# EAGLE design RG_Medium_Matrix (EAGLE 6.5.0)
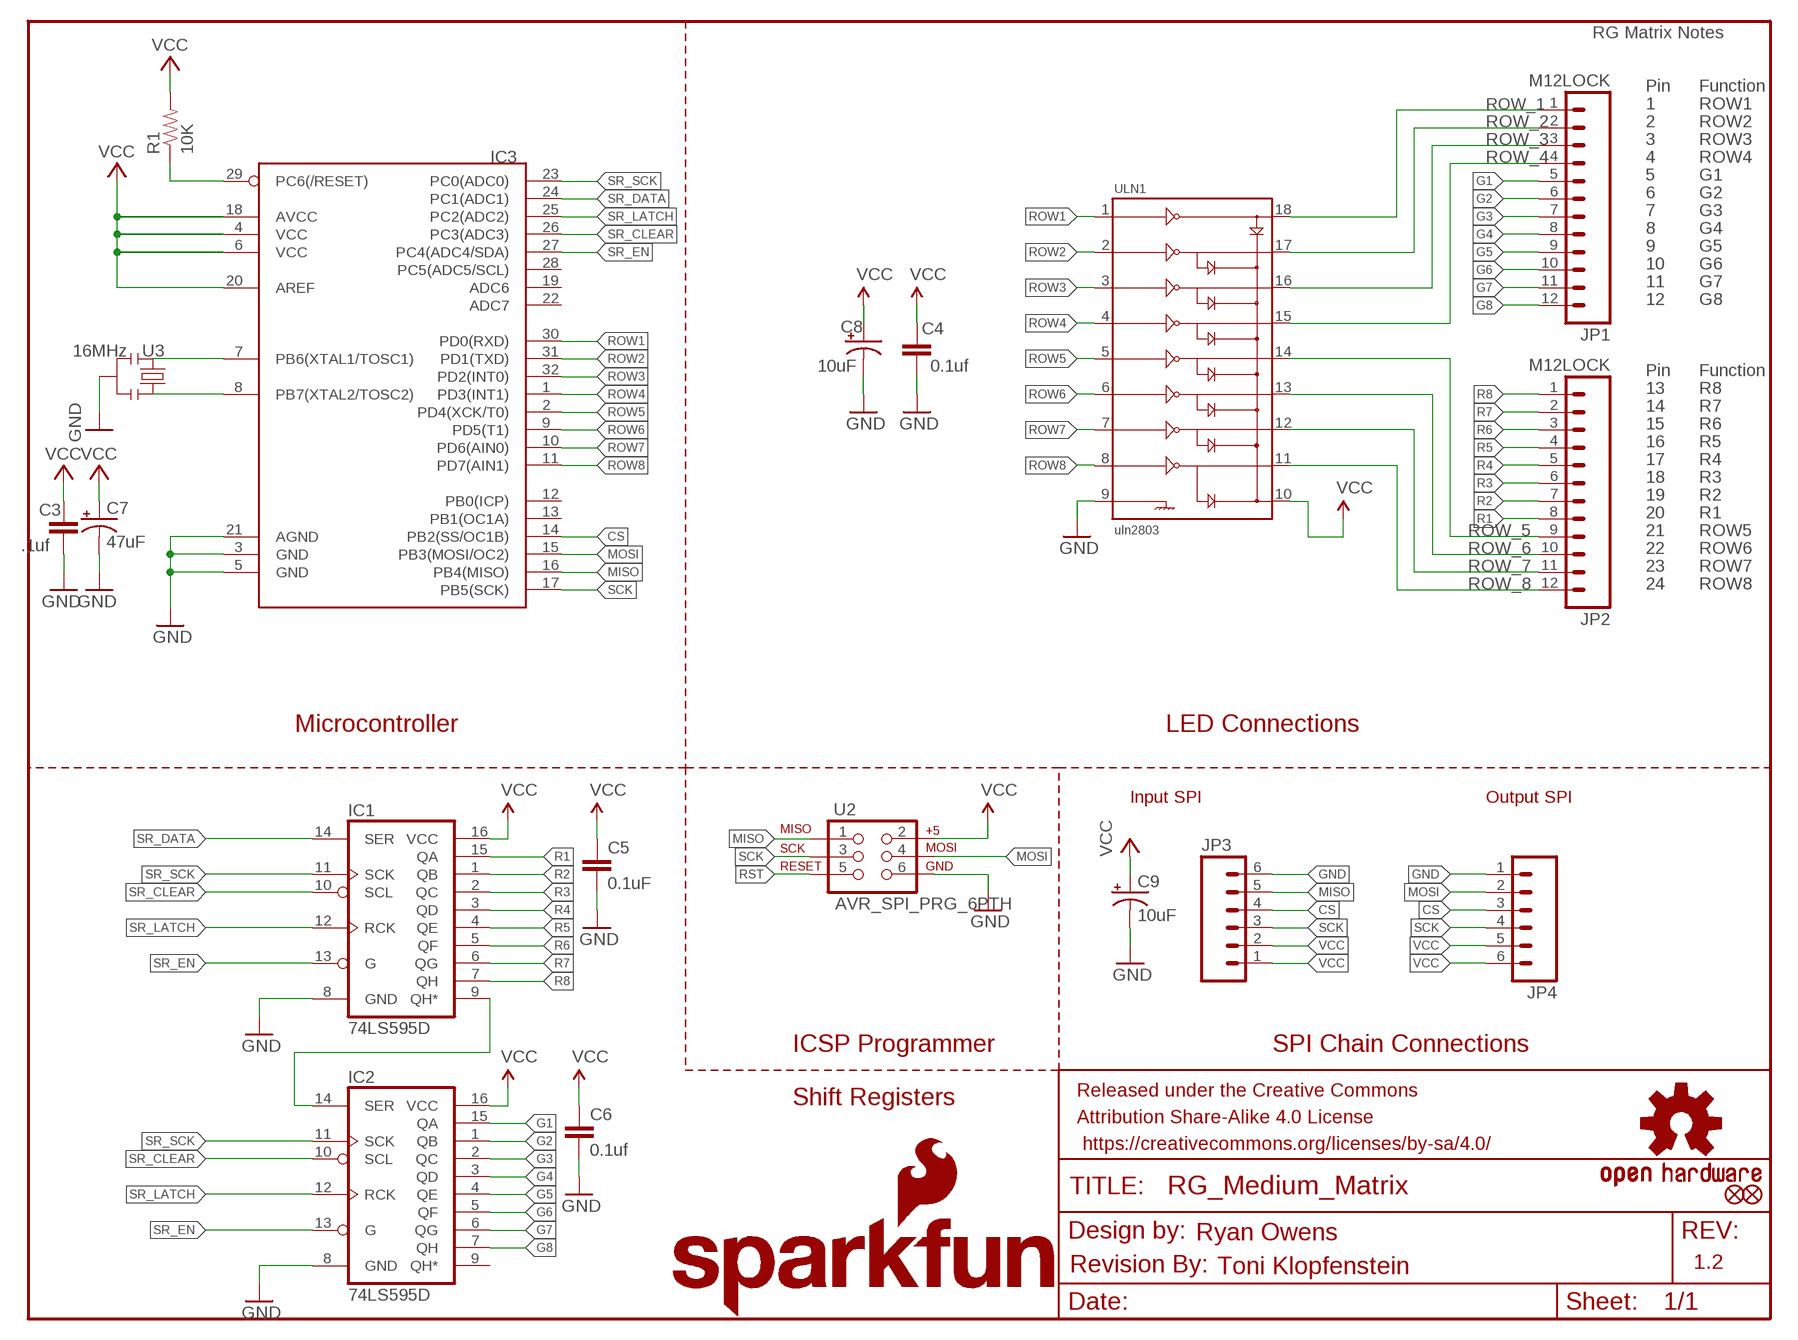
[diagram p0: schematic, sheet 1]

## Parts
C3  .1uf  0.1UF-25V(+80/-20%)(0603)  [0603-CAP]
C4  0.1uf  0.1UF-25V(+80/-20%)(0603)  [0603-CAP]
C5  0.1uF  0.1UF-25V(+80/-20%)(0603)  [0603-CAP]
C6  0.1uf  0.1UF-25V(+80/-20%)(0603)  [0603-CAP]
C7  47uF  CAP_POL3528  [EIA3528]
C8  10uF  CAP_POL1206  [EIA3216]
C9  10uF  CAP_POL1206  [EIA3216]
FRAME1  FRAME-LETTER  [CREATIVE_COMMONS]
IC1  74LS595D  [SO16]
IC2  74LS595D  [SO16]
IC3  ATMEGA328_SMT  [TQFP32-08]
JP1  M12LOCK  [1X12_LOCK]
JP2  M12LOCK  [1X12_LOCK]
JP3  M06LOCK  [1X06_LOCK]
JP4  M06LOCK  [1X06_LOCK]
LOGO1  OSHW-LOGOS  [OSHW-LOGO-S]
LOGO2  SFE_LOGO_NAME_FLAME.1_INCH  [SFE_LOGO_NAME_FLAME_.1]
R1  10K  10KOHM1/10W1%(0603)0603  [0603-RES]
U2  AVR_SPI_PRG_6PTH  [2X3]
U3  16MHz  RESONATORSMD  [RESONATOR-SMD]
U$1  FIDUCIAL1X2  [FIDUCIAL-1X2]
U$2  REVISION  [REVISION]
U$3  FIDUCIAL1X2  [FIDUCIAL-1X2]
ULN1  uln2803  ULN2803SOICW  [SO18L]

## Nets
CS: IC3.14(PB2(SS/OC1B)) JP3.4 JP4.3
G1: IC2.15(QA) JP1.5
G2: IC2.1(QB) JP1.6
G3: IC2.2(QC) JP1.7
G4: IC2.3(QD) JP1.8
G5: IC2.4(QE) JP1.9
G6: IC2.5(QF) JP1.10
G7: IC2.6(QG) JP1.11
G8: IC2.7(QH) JP1.12
GND: C3.2 C4.1 C5.2 C6.2 C7.C(-) C8.C(-) C9.C(-) IC1.8(GND) IC2.8(GND) IC3.3(GND) IC3.5(GND) IC3.21(AGND) JP3.6 JP4.1 U2.6 U3.2 ULN1.9
MISO: IC3.16(PB4(MISO)) JP3.5 U2.1
MOSI: IC3.15(PB3(MOSI/OC2)) JP4.2 U2.4
N$1: IC3.7(PB6(XTAL1/TOSC1)) U3.1
N$2: IC3.8(PB7(XTAL2/TOSC2)) U3.3
N$30: IC1.9(QH*) IC2.14(SER)
R1: IC1.15(QA) JP2.8
R2: IC1.1(QB) JP2.7
R3: IC1.2(QC) JP2.6
R4: IC1.3(QD) JP2.5
R5: IC1.4(QE) JP2.4
R6: IC1.5(QF) JP2.3
R7: IC1.6(QG) JP2.2
R8: IC1.7(QH) JP2.1
ROW1: IC3.30(PD0(RXD)) ULN1.1
ROW2: IC3.31(PD1(TXD)) ULN1.2
ROW3: IC3.32(PD2(INT0)) ULN1.3
ROW4: IC3.1(PD3(INT1)) ULN1.4
ROW5: IC3.2(PD4(XCK/T0)) ULN1.5
ROW6: IC3.9(PD5(T1)) ULN1.6
ROW7: IC3.10(PD6(AIN0)) ULN1.7
ROW8: IC3.11(PD7(AIN1)) ULN1.8
ROW_1: JP1.1 ULN1.18
ROW_2: JP1.2 ULN1.17
ROW_3: JP1.3 ULN1.16
ROW_4: JP1.4 ULN1.15
ROW_5: JP2.9 ULN1.14
ROW_6: JP2.10 ULN1.13
ROW_7: JP2.11 ULN1.12
ROW_8: JP2.12 ULN1.11
RST: IC3.29(PC6(/RESET)) R1.1 U2.5
SCK: IC3.17(PB5(SCK)) JP3.3 JP4.4 U2.3
SR_CLEAR: IC1.10(SCL) IC2.10(SCL) IC3.26(PC3(ADC3))
SR_DATA: IC1.14(SER) IC3.24(PC1(ADC1))
SR_EN: IC1.13(G) IC2.13(G) IC3.27(PC4(ADC4/SDA))
SR_LATCH: IC1.12(RCK) IC2.12(RCK) IC3.25(PC2(ADC2))
SR_SCK: IC1.11(SCK) IC2.11(SCK) IC3.23(PC0(ADC0))
VCC: C3.1 C4.2 C5.1 C6.1 C7.A(+) C8.A(+) C9.A(+) IC1.16(VCC) IC2.16(VCC) IC3.4(VCC) IC3.6(VCC) IC3.18(AVCC) IC3.20(AREF) JP3.1 JP3.2 JP4.5 JP4.6 R1.2 U2.2 ULN1.10
Unconnected: IC2.9(QH*) IC3.12(PB0(ICP)) IC3.13(PB1(OC1A)) IC3.19(ADC6) IC3.22(ADC7) IC3.28(PC5(ADC5/SCL))

## Notes on the sheet
- RG Matrix Notes
- Pin | Function
- 1 | ROW1
- 2 | ROW2
- 3 | ROW3
- 4 | ROW4
- 5 | G1
- 6 | G2
- 7 | G3
- 8 | G4
- 9 | G5
- 10 | G6
- 11 | G7
- 12 | G8
- Pin | Function
- 13 | R8
- 14 | R7
- 15 | R6
- 16 | R5
- 17 | R4
- 18 | R3
- 19 | R2
- 20 | R1
- 21 | ROW5
- 22 | ROW6
- 23 | ROW7
- 24 | ROW8
- Microcontroller | LED Connections
- Input SPI | Output SPI
- ICSP Programmer | SPI Chain Connections
- Shift Registers
- Ryan Owens
- Toni Klopfenstein | 1.2

## Library data of the parts
C3 C4 C6 = SparkFun-Capacitors:0.1UF-25V(+80/-20%)(0603): CAP-00810 Ceramic Standard decoupling cap; PROD_ID: CAP-00810; VALUE: 0.1uF
C5 = SparkFun-Capacitors:0.1UF-25V(+80/-20%)(0603): CAP-00810 Ceramic Standard decoupling cap; PROD_ID: CAP-00810
C7-C9 = SparkFun:CAP_POL: Capacitor Polarized These are standard SMD and PTH capacitors. Normally 10uF, 47uF, and 100uF in electrolytic and tantalum varieties. Always verify the external diameter of the through hole cap, it varies with capacity, voltage, and manufacturer. The EIA devices should be standard.
FRAME1 = SparkFun-Aesthetics:FRAME-LETTER: Schematic Frame Standard 8.5x11 US Letter frame
IC1 IC2 = SparkFun:74*595: 8-bit SHIFT REGISTER, output latch
IC3 = SparkFun-DigitalIC:ATMEGA328_SMT: 32-Pin Atmega328 part Commonly used on Arduino compatible boards Available in QFP and QFN packages TQFP is IC-09069 QFN is non-stock; PROD_ID: IC-09069; VALUE: ATMEGA328P
JP1 JP2 = SparkFun-Connectors:M12: Header 12 Standard 12-pin 0.1" header. Use with straight break away headers (SKU : PRT-00116), right angle break away headers (PRT-00553), swiss pins (PRT-00743), machine pins (PRT-00117), and female headers (PRT-00115).
JP3 JP4 = SparkFun-Connectors:M06: Header 6 Standard 6-pin 0.1" header. Use with straight break away headers (SKU : PRT-00116), right angle break away headers (PRT-00553), swiss pins (PRT-00743), machine pins (PRT-00117), and female headers (PRT-00115). Molex polarized connector foot print use with SKU : PRT-08094 with associated crimp pins and housings. NOTES ON THE VARIANTS LOCK and LOCK_LONGPADS... This footprint was designed to help hold the alignment of a through-hole component (i.e. 6-pin header) while soldering it into place. You may notice that each hole has been shifted either up or down by 0.005 of an inch from it's more standard position (which is a perfectly straight line). This slight alteration caused the pins (the squares in the middle) to touch the edges of the holes. Because they are alternating, it causes a "brace" to hold the component in place. 0.005 has proven to be the perfect amount of "off-center" position when using our standard breakaway headers. Although looks a little odd when you look at the bare footprint, once you have a header in there, the alteration is very hard to notice. Also,if you push a header all the way into place, it is covered up entirely on the bottom side. This idea of altering the position of holes to aid alignment will be further integrated into the Sparkfun Library for other footprints. It can help hold any component with 3 or more connection pins.
LOGO1 = SparkFun-Aesthetics:OSHW-LOGO: Open Source Hardware Logo This logo indicates the piece of hardware it is found on incorporates a OSHW license and/or adheres to the definition of open source hardware found here: http://freedomdefined.org/OSHW
LOGO2 = SparkFun-Aesthetics:SFE_LOGO_NAME_FLAME: SFE Logo, name and flame This is the SparkFun full logo. The logo on the schematic will always be the same size; the package variant is the height of the flame part of the logo. Default layer for the logo on the board is tSilk.
R1 = SparkFun-Resistors:10KOHM1/10W1%(0603): RES-00824; PROD_ID: RES-00824
U2 = SparkFun-Connectors:AVR_SPI_PRG_6: AVR ISP 6 Pin This is the reduced ISP connector for AVR programming. Common on Arduino. This footprint will take up less PCB space and can be used with a 10-pin to 6-pin adapter such as SKU: BOB-08508 **Special note about "TEST_POINT" package. The stop mask is on the top side, so if you want your programming test points to be on the bottom of your board, make sure to place this package on the bottom side of the board. This also ensure that the orientation to program from the bottom side will be correct.
U3 = SparkFun:RESONATOR: Resonator Small SMD resonator. This is the itty bitty 10/20MHz resonators with built in caps. CSTCE10M0G55 and CSTCE20M0V53. Footprint has been reviewed closely but hasn't been tested yet.
U$1 U$3 = SparkFun:FIDUCIAL: Fiducial Alignment Points Various fiducial points for machine vision alignment.
U$2 = SparkFun-Aesthetics:REVISION
ULN1 = SparkFun:ULN2803: Darlington Driver ULN2803 Darlington array. 500mA max per channel, 8-channel package. Spark Fun Electronics SKU : COM-00312

## Net classes
0 DEFAULT: width 0.203 mm
1 power: width 0.356 mm

## Board
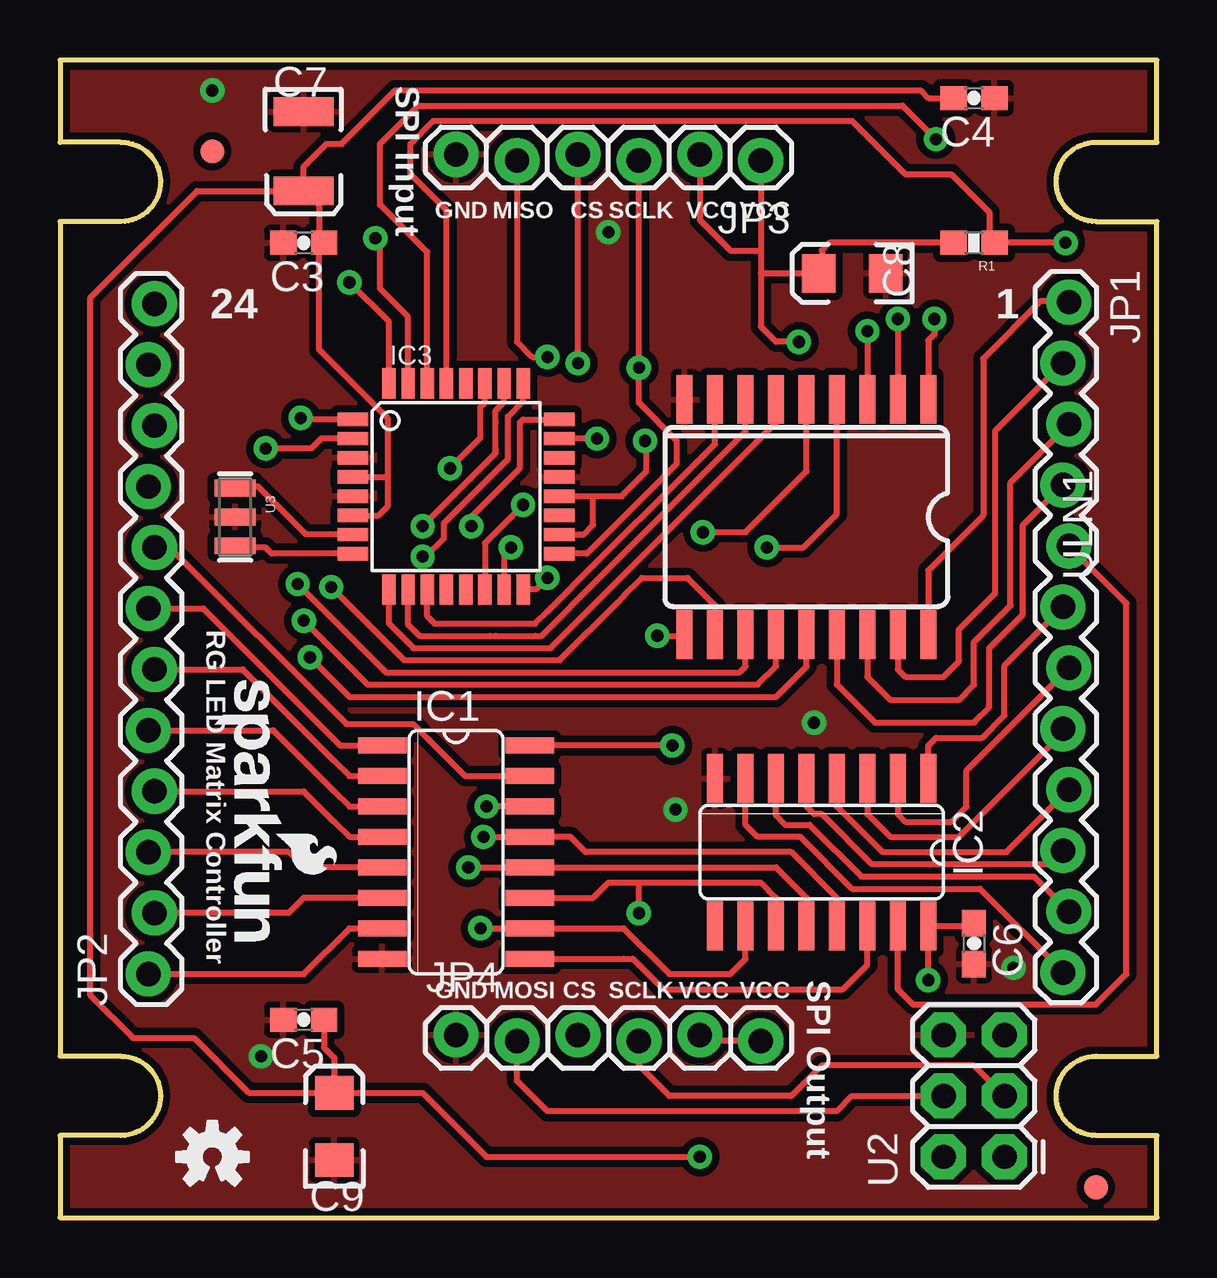
[diagram p1: board, top side]
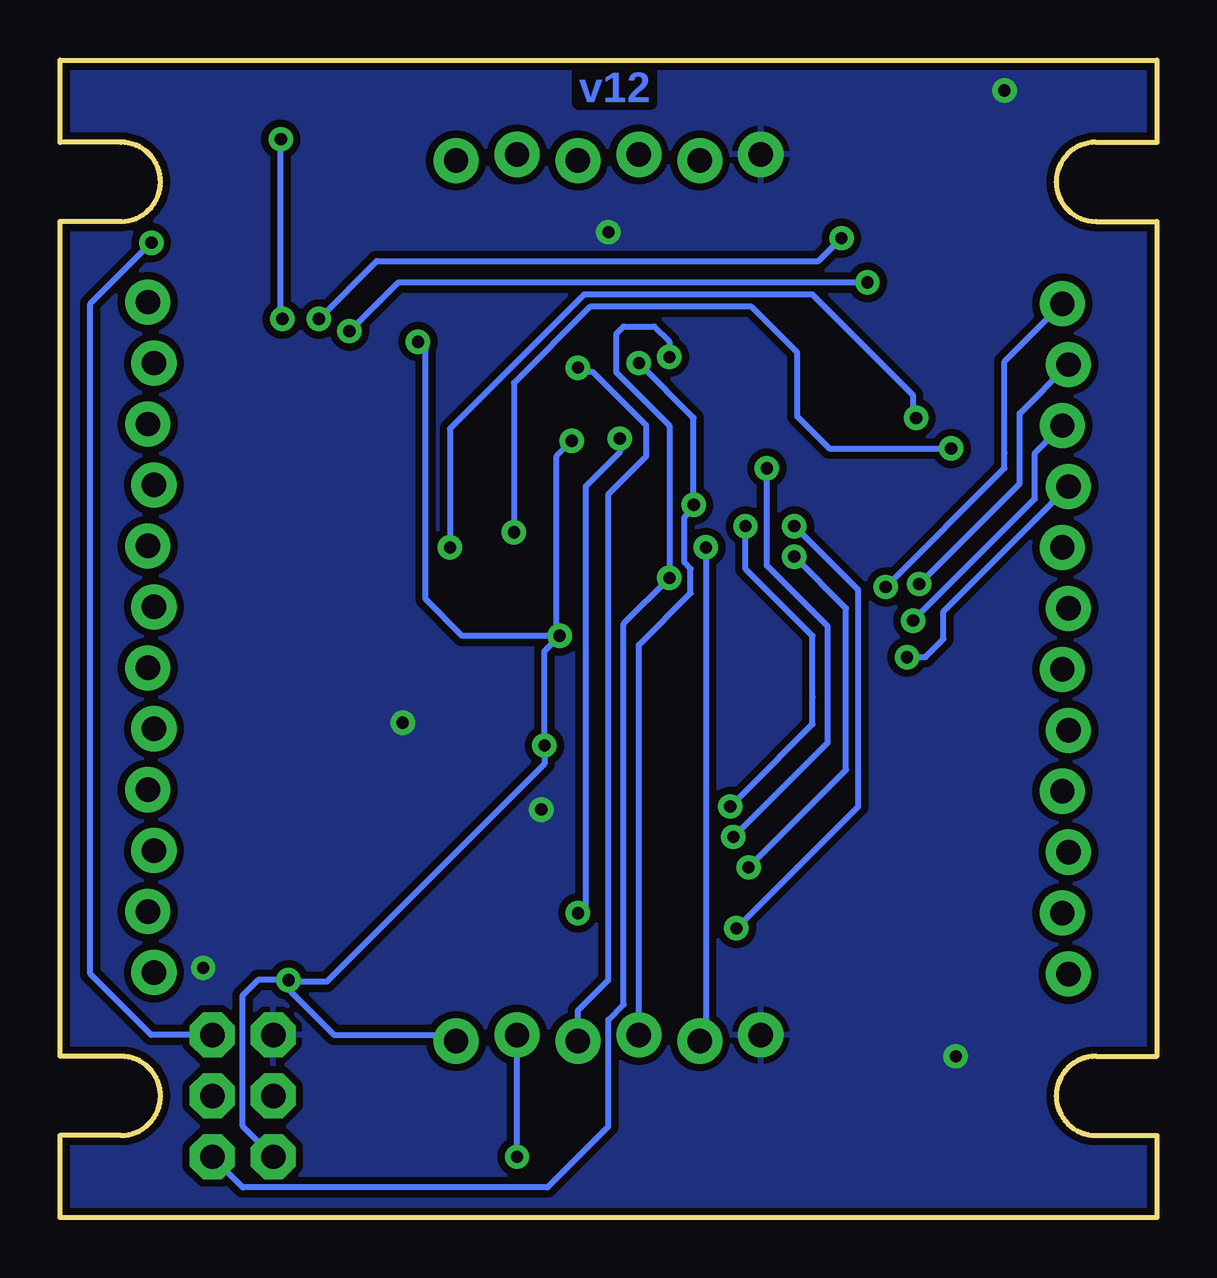
[diagram p2: board, bottom side, seen from below]

Size 45.72 x 48.26 mm. Coordinates in mm from the lower left corner, seen from the top.
Outline: 0,0 45.72,0 45.72,3.43 43.18,3.43 arc-180 43.18,6.73 45.72,6.73 45.72,41.53 43.18,41.53 arc-180 43.18,44.83 45.72,44.83 45.72,48.26 0,48.26 0,44.83 2.54,44.83 arc-180 2.54,41.53 0,41.53 0,6.73 2.54,6.73 arc-180 2.54,3.43 0,3.43 0,0
Copper layers (1*16): Top 0.035mm / dielectric 1.5mm / Bottom 0.035mm
Design rules "SparkFun-2-layer": minimum track width 7mil, minimum drill 15mil, track to track 8mil, track to pad 8mil, pad to pad 8mil, via to via 8mil, smd to smd 8mil, copper to edge 8mil, drill to drill 8mil, minimum pad ring 12mil, minimum via ring 10mil, stop-mask expansion 4mil, vias tented up to drill 20mil, thermal gap 10mil

### Footprints (pad centres in the part's own frame; a part is rotated, then mirrored left to right if it is on the bottom)
0603-CAP = smd 1.1 x 1: 1 -0.85,0; 2 0.85,0
EIA3528 = smd 1.2 x 2.5: A 1.65,0; C -1.65,0
EIA3216 = smd 1.4 x 1.6: A 1.4,0; C -1.4,0
SO16 = smd 0.66 x 2.032: 1 -4.445,-3.073; 2 -3.175,-3.073; 3 -1.905,-3.073; 4 -0.635,-3.073; 5 0.635,-3.073; 6 1.905,-3.073; 7 3.175,-3.073; 8 4.445,-3.073; 9 4.445,3.073; 10 3.175,3.073; 11 1.905,3.073; 12 0.635,3.073; 13 -0.635,3.073; 14 -1.905,3.073; 15 -3.175,3.073; 16 -4.445,3.073
TQFP32-08 = smd 1.27 x 0.559: 1 -4.293,2.8; 2 -4.293,2; 3 -4.293,1.2; 4 -4.293,0.4; 5 -4.293,-0.4; 6 -4.293,-1.2; 7 -4.293,-2; 8 -4.293,-2.8; 17 4.293,-2.8; 18 4.293,-2; 19 4.293,-1.2; 20 4.293,-0.4; 21 4.293,0.4; 22 4.293,1.2; 23 4.293,2; 24 4.293,2.8 | smd 0.559 x 1.27: 9 -2.8,-4.293; 10 -2,-4.293; 11 -1.2,-4.293; 12 -0.4,-4.293; 13 0.4,-4.293; 14 1.2,-4.293; 15 2,-4.293; 16 2.8,-4.293; 25 2.8,4.293; 26 2,4.293; 27 1.2,4.293; 28 0.4,4.293; 29 -0.4,4.293; 30 -1.2,4.293; 31 -2,4.293; 32 -2.8,4.293
1X12_LOCK = drill 1.016 pad 1.88: 1 0,0.127; 2 2.54,-0.127; 3 5.08,0.127; 4 7.62,-0.127; 5 10.16,0.127; 6 12.7,-0.127; 7 15.24,0.127; 8 17.78,-0.127; 9 20.32,0.127; 10 22.86,-0.127; 11 25.4,0.127; 12 27.94,-0.127
1X06_LOCK = drill 1.016 pad 1.88: 1 0,0; 2 2.54,-0.254; 3 5.08,0; 4 7.62,-0.254; 5 10.16,0; 6 12.7,-0.254
0603-RES = smd 1.1 x 1: 1 -0.85,0; 2 0.85,0
2X3 = drill 1.016 pad 1.88 octagon: 1 0,0; 2 0,2.54; 3 2.54,0; 4 2.54,2.54; 5 5.08,0; 6 5.08,2.54
RESONATOR-SMD = smd 0.7 x 1.7: 1 -1.2,0; 2 0,0; 3 1.2,0
FIDUCIAL-1X2 = smd 1 x 1: 1 0,0
SO18L = smd 0.66 x 2.032: 1 -0.635,-4.902; 2 0.635,-4.902; 3 1.905,-4.902; 4 3.175,-4.902; 5 4.445,-4.902; 6 5.715,-4.902; 7 6.985,-4.902; 8 8.255,-4.902; 9 9.525,-4.902; 10 9.525,4.902; 11 8.255,4.902; 12 6.985,4.902; 13 5.715,4.902; 14 4.445,4.902; 15 3.175,4.902; 16 1.905,4.902; 17 0.635,4.902; 18 -0.635,4.902

### Placement (x,y rotation side)
C3  10.16,40.64 180 top
C4  38.1,46.67 180 top
C5  10.16,8.26 180 top
C6  38.1,11.43 270 top
C7  10.16,44.45 270 top
C8  33.02,39.37 180 top
C9  11.43,3.81 90 top
FRAME1  2.9,-10.16 0 top  (outside the outline)
IC1  16.51,15.24 270 top
IC2  31.75,15.24 180 top
IC3  16.51,30.48 0 top
JP1  41.93,38.16 270 top
JP2  3.81,10.16 90 top
JP3  29.21,44.07 180 top
JP4  16.51,7.62 0 top
LOGO1  6.35,2.54 0 top
LOGO2  6.35,22.86 270 top
R1  38.1,40.64 180 top
U2  39.37,2.54 90 top
U3  7.3,29.21 270 top
U$1  6.35,44.45 0 top
U$2  14.48,-12.95 0 top  (outside the outline)
U$3  43.18,1.27 0 top
ULN1  35.56,29.21 180 top

### Tracks (layer width: path | path; a pad name or v marks a point on that pad's centre or on a via)
CS  (via drill 0.51)
  Top 0.254: v21.59,35.62 JP3.4 | IC3.14 17.71,28.12 v19.3,29.72
  Bottom 0.254: JP4.3 21.59,23.88 19.43,26.04 19.43,27.05 19.68,27.3 19.68,29.21 19.3,29.59 v19.3,29.72 19.3,33.34 v21.59,35.62
G1
  Top 0.254: IC2.15 34.92,9.53 35.56,8.89 43.18,8.89 44.45,10.16 44.45,25.61 JP1.5
G2
  Top 0.254: IC2.1 36.2,19.68 36.51,20 38.42,20 39.37,20.95 39.37,23.03 JP1.6
G3
  Top 0.254: IC2.2 34.92,16.83 35.24,16.51 37.15,16.51 37.78,17.14 37.78,18.65 JP1.7
G4
  Top 0.254: IC2.3 33.66,16.83 34.61,15.88 37.47,15.88 41.8,20.21 JP1.8
G5
  Top 0.254: IC2.4 32.38,17.14 34.29,15.24 39.45,15.24 JP1.9
G6
  Top 0.254: 42.04,15.37 41.97,15.3 | 41.97,15.3 JP1.10 | 41.97,15.3 41.4,14.73 33.85,14.73 31.75,16.83 31.43,16.83 31.11,17.14 IC2.5
G7
  Top 0.254: IC2.6 29.84,16.76 30.23,16.38 31.24,16.38 33.4,14.22 40.6,14.22 JP1.11
G8
  Top 0.254: IC2.7 28.57,16.38 29.08,15.88 30.86,15.88 33.02,13.72 38.35,13.72 41.8,10.27 JP1.12
GND  (via drill 0.51)
  other vias: 39.75,10.41 25.65,17.02 8.38,6.73 22.86,41.08 6.35,46.99 31.43,20.64
  pour Top (isolate 0.305): 0,48.27 45.72,48.25 45.72,0 0,0
  pour Bottom (isolate 0.305): -0.02,0 45.71,0 45.74,48.26 -0.03,48.28
MISO  (via drill 0.51)
  Top 0.254: IC3.16 19.84,26.19 v20.32,26.67 | JP3.5 19.05,36.51 19.68,35.88 v20.32,35.88
  Bottom 0.254: U2.1 38.1,1.27 25.4,1.27 22.86,3.81 22.86,8.26 22.23,8.89 22.23,24.77 v20.32,26.67 20.32,33.02 22.54,35.24 22.54,36.83 22.23,37.15 20.95,37.15 20.32,36.51 v20.32,35.88
MOSI  (via drill 0.51)
  Top 0.254: IC3.15 18.51,27.65 v18.8,27.94 | U2.4 33.02,5.08 32.38,4.45 20.32,4.45 19.05,5.71 JP4.2
  Bottom 0.254: 18.67,27.81 v18.8,27.94 18.8,7.62 JP4.2
N$1
  Top 0.254: IC3.7 10.26,28.48 8.26,30.48 7.37,30.48 U3.1
N$2
  Top 0.254: IC3.8 8.83,27.68 8.57,27.94 7.37,27.94 U3.3
N$30
  Top 0.254: IC1.9 23.5,10.79 23.88,10.79 25.15,9.53 32.64,9.53 33.66,10.54 33.66,10.79 IC2.14
R1
  Top 0.254: IC1.15 16.89,18.41 15.37,19.94 14.73,20.57 11.94,20.57 4.57,27.94 4.06,27.94 JP2.8
R2
  Top 0.254: IC1.1 11.68,19.68 11.18,20.19 5.97,25.4 JP2.7
R3
  Top 0.254: IC1.2 12.06,18.41 11.43,19.05 7.62,22.86 JP2.6
R4
  Top 0.254: IC1.3 12.06,17.14 11.43,17.78 8.89,20.32 JP2.5
R5
  Top 0.254: IC1.4 12.06,15.88 11.43,16.51 10.16,17.78 JP2.4
R6
  Top 0.254: IC1.5 10.16,14.61 9.53,15.24 JP2.3
R7
  Top 0.254: IC1.6 10.16,13.34 9.53,12.7 JP2.2
R8
  Top 0.254: IC1.7 12.06,12.06 10.16,10.16 JP2.1
ROW1  (via drill 0.51)
  Top 0.254: v36.45,37.47 36.45,36.83 36.2,36.58 ULN1.1 | IC3.30 15.31,40.25 13.34,42.23 13.34,44.77 14.92,46.35 35.12,46.35 35.43,46.04 35.66,45.81 v36.51,44.96
  Bottom 0.254: v36.45,37.47 36.51,37.53 v36.51,44.96
ROW2  (via drill 0.51)
  Top 0.254: v34.92,37.47 ULN1.2 | IC3.31 14.51,37.56 13.34,38.73 13.34,40.64 v13.14,40.83
  Bottom 0.254: v34.92,37.47 32.51,39.88 14.1,39.88 v13.14,40.83
ROW3  (via drill 0.51)
  Top 0.254: v33.66,36.96 ULN1.3 | IC3.32 13.71,37.34 v12.06,38.99
  Bottom 0.254: v12.06,38.99 31.62,38.99 v33.66,36.96
ROW4  (via drill 0.51)
  Top 0.254: ULN1.4 32.38,29.34 30.99,27.94 v29.46,27.94 | IC3.1 10.09,33.28 v10.03,33.34
  Bottom 0.254: v29.46,27.94 29.46,32.89 23.88,38.48 14.35,38.48 10.16,34.29 10.16,33.47 v10.03,33.34
ROW5  (via drill 0.51)
  Top 0.254: v26.8,28.57 28.57,28.57 31.11,31.11 ULN1.5 | IC3.2 10.89,32.48 10.48,32.07 v8.57,32.07
  Bottom 0.254: v26.8,28.57 26.8,34.8 23.62,37.97 16.89,37.97 14.99,36.07 14.99,33.4 13.65,32.07 v8.57,32.07
ROW6
  Top 0.254: ULN1.6 29.84,33.15 22.86,26.16 20.45,23.75 19.81,23.75 17.14,23.75 16.89,23.75 14.73,23.75 13.71,24.77 IC3.9
ROW7
  Top 0.254: ULN1.7 28.57,32.77 27.69,31.88 22.48,26.67 20.07,24.26 19.81,24.26 18.16,24.26 17.91,24.26 14.99,24.26 14.51,24.73 IC3.10
ROW8
  Top 0.254: ULN1.8 27.3,32.26 26.04,30.99 22.23,27.18 20.45,25.4 20.32,25.27 19.81,24.77 18.92,24.77 18.54,24.77 18.16,24.77 15.62,24.77 15.31,25.08 IC3.11
ROW_1
  Top 0.254: ULN1.18 36.2,26.99 38.48,29.27 38.48,35.81 40.89,38.23 42,38.23 JP1.1
ROW_2
  Top 0.254: ULN1.17 34.92,22.86 35.24,22.54 36.83,22.54 37.47,23.18 37.47,24.51 38.99,26.04 38.99,32.81 JP1.2
ROW_3
  Top 0.254: ULN1.16 33.66,22.54 34.61,21.59 37.47,21.59 38.1,22.23 38.1,24 39.62,25.53 39.62,30.65 JP1.3
ROW_4
  Top 0.254: ULN1.15 32.38,22.23 33.97,20.64 38.1,20.64 38.73,21.27 38.73,23.75 40.13,25.15 40.13,28.87 JP1.4
ROW_5  (via drill 0.51)
  Top 0.254: ULN1.14 31.11,22.99 29.84,21.72 12.06,21.72 v10.41,23.37
  Bottom 0.254: v10.41,23.37 9.65,23.37 8.89,24.13 8.89,25.27 JP2.9
ROW_6  (via drill 0.51)
  Top 0.254: ULN1.13 29.84,22.99 29.08,22.23 12.83,22.23 v10.16,24.89
  Bottom 0.254: v10.16,24.89 5.08,29.97 5.08,31.88 JP2.10
ROW_7  (via drill 0.51)
  Top 0.254: ULN1.12 28.57,22.99 28.32,22.73 13.59,22.73 v9.91,26.42
  Bottom 0.254: v9.91,26.42 5.71,30.61 5.71,33.53 JP2.11
ROW_8  (via drill 0.51)
  Top 0.254: ULN1.11 27.3,25.53 26.16,26.67 24.26,26.67 23.5,25.91 23.24,25.65 20.83,23.24 20.32,23.24 19.94,23.24 14.35,23.24 11.94,25.65 v11.3,26.29
  Bottom 0.254: v11.3,26.29 6.35,31.24 6.35,31.88 6.35,35.69 JP2.12
RST  (via drill 0.51)
  Top 0.254: 38.75,40.75 38.73,40.77 38.82,40.77 R1.1 | v41.91,40.64 R1.1 | 38.73,40.85 R1.1 | 38.73,40.85 38.73,41.91 37.15,43.5 35.24,43.5 33.02,45.72 15.56,45.72 14.61,44.77 14.61,43.5 16.11,41.99 IC3.29 | 38.73,40.85 38.73,40.64
  Bottom 0.254: U2.5 41.91,7.62 44.45,10.16 44.45,38.1 v41.91,40.64
SCK  (via drill 0.51)
  Top 0.254: IC3.17 21.96,27.68 25.72,31.43 25.72,32.38 24.13,33.97 v24.13,35.43 JP3.3 | U2.3 38.1,6.35 31.75,6.35 30.48,5.08 25.4,5.08 24.13,6.35 JP4.4
  Bottom 0.254: JP4.4 24.13,8.64 22.86,9.91 22.86,30.16 21.27,31.75 21.27,33.02 23.5,35.24 23.94,35.24 v24.13,35.43
SR_CLEAR  (via drill 0.51)
  Top 0.254: IC2.10 28.57,10.79 27.94,10.16 25.4,10.16 23.5,12.06 IC1.10 19.18,12.06 v17.53,12.06 | v15.11,28.83 15.24,28.96 16.76,30.48 18.16,31.88 18.16,32 18.16,33.15 18.16,33.66 18.51,34 IC3.26
  Bottom 0.254: v17.53,12.06 14.99,14.61 12.45,17.14 12.45,20.57 12.45,26.16 14.99,28.7 v15.11,28.83
SR_DATA  (via drill 0.51)
  Top 0.254: IC3.24 19.31,33.28 19.18,33.15 19.18,31.24 18.41,30.48 17.14,29.21 v17.14,28.83 | IC1.14 17.91,17.14 v17.78,17.14
  Bottom 0.254: v17.78,17.14 17.14,17.78 14.35,20.57 14.35,21.72 14.35,24.26 17.14,27.05 17.14,28.45 v17.14,28.83
SR_EN  (via drill 0.51)
  Top 0.254: v17.65,15.88 IC1.13 21.27,15.88 21.91,15.24 30.48,15.24 32.38,13.34 IC2.13 | IC3.27 17.71,33.97 17.53,33.78 17.53,32.51 v16.26,31.24
  Bottom 0.254: v17.65,15.88 13.72,19.81 13.72,24.64 16.26,27.18 v16.26,31.24
SR_LATCH  (via drill 0.51)
  Top 0.254: v17.02,14.61 IC1.12 29.84,14.61 31.11,13.34 IC2.12 | IC3.25 19.31,34.04 18.67,33.4 18.67,31.62 16,28.96 16,28.32 15.24,27.56 v15.11,27.56
  Bottom 0.254: v15.11,27.56 12.95,25.4 12.95,18.67 v17.02,14.61
SR_SCK  (via drill 0.51)
  Top 0.254: IC1.11 22.23,13.34 22.86,13.97 24.13,13.97 | IC2.11 29.84,13.34 29.21,13.97 24.13,13.97 | v22.38,32.48 IC3.23 | v24.13,12.7 24.13,13.97
  Bottom 0.254: v22.38,32.48 22.38,31.91 23.81,30.48 23.81,13.02 v24.13,12.7
VCC  (via drill 0.51)
  Top 0.254: C6.1 38.1,12.06 38,12.17 IC2.16 v36.2,9.91 | v25.53,19.68 IC1.16 | ULN1.10 26.04,24.26 v24.89,24.26 | C8.A | 37.47,40.64 R1.2 32.07,40.64 31.75,40.32 31.75,39.37 C8.A | C9.A | 29.21,39.37 C8.A | C9.A 15.11,5.21 17.78,2.54 v26.67,2.54 | C7.A 10.16,43.18 | 10.16,43.18 9.78,42.8 | C7.A | C9.A 7.87,5.21 5.59,7.49 3.05,7.49 1.27,9.27 1.27,38.35 5.71,42.8 10.03,42.8 C7.A | IC3.6 13.28,29.28 13.65,29.65 13.65,30.8 | 21.62,28.48 IC3.18 21.81,28.48 22.23,28.89 22.23,30.08 | C5.1 11.01,7.09 11.43,6.67 C9.A | 31.75,39.5 C8.A | IC3.20 22.23,30.08 | 22.23,30.08 23.41,30.08 24.45,31.11 24.45,32.32 v24.38,32.38 | 13.65,30.8 13.65,33.34 10.79,36.2 10.79,40.42 C3.1 10.79,40.64 10.79,42.23 10.22,42.8 C7.A | IC3.4 13.57,30.88 13.65,30.8 | v30.8,36.51 29.84,36.51 29.21,37.15 29.21,39.37 | JP3.1 29.21,40.32 | 29.21,40.32 29.21,39.37 | 10.16,43.18 10.16,43.81 11.11,44.77 11.75,44.77 13.97,46.99 35.88,46.99 36.2,46.67 C4.2 | JP3.2 26.67,41.59 27.94,40.32 29.21,40.32 | JP4.6 26.92,7.37 JP4.5
  Bottom 0.254: v24.89,24.26 25.02,24.38 25.02,31.75 v24.38,32.38 | v24.89,24.26 28.96,24.26 30.48,25.78 30.48,36.2 v30.8,36.51 | U2.2 36.96,2.54 36.96,2.67 38.1,3.81 38.1,9.27 37.47,9.91 v36.2,9.91 36.13,9.84 | v24.89,24.26 25.53,23.62 v25.53,19.68 25.53,18.92 34.61,9.84 36.13,9.84 | 36.13,9.84 36.2,9.78 36.2,9.53 34.29,7.62 29.46,7.62 JP4.6 | v26.67,2.54 JP4.5

### Text on the board
Bottom: v12
tPlace: SPI Input | GND | MISO | CS | SCLK | VCC | VCC | 24 | 1 | RG LED Matrix Controller | SPI Output | GND | MOSI | CS | SCLK | VCC | VCC
tValues: DNP | Polarized Male 6 pin header | ATMEGA328 | 12-pin Female Header | 16MHz | ULN2803 | 12-pin Female Header | NOTE: | The two sets of 12 breakout pins | should be populated with Female | breakout headers, mounted on the BACK | side of the board. (i.e. Not the component side) | DNP | RG Serial Controller
bValues: SPI/ICSP
Measures: COLUMN 8 | ROW8 | COLUMN 7 | ROW1 | ROW7 | ROW2 | ROW6 | ROW3 | COLUMN 6 | ROW5 | ROW4 | R1 | G1 | COLUMN 5 | R2 | G2 | R3 | G3 | COLUMN 4 | R4 | G4 | R5 | G5 | COLUMN 3 | R6 | G6 | R7 | G7 | COLUMN 2 | R8 | G8 | COLUMN 1 | ROW 1 | ROW 2 | ROW 3 | ROW 4 | ROW 5 | ROW 6 | ROW 7 | ROW 8
tDocu: Ryan Owens | Toni Klopfenstein